# EAGLE design rj45board (EAGLE 7.2.0)
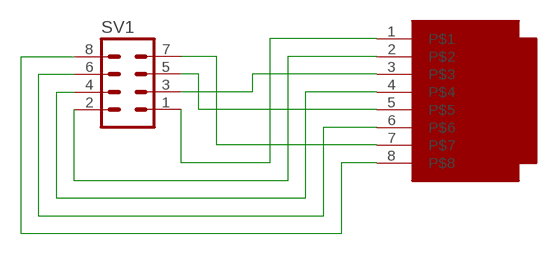
[diagram p0: schematic, sheet 1]

## Parts
SV1  MA04-2  [MA04-2]
U$1  MODULARBUCHSE  [MODULARBUCHSESMD]

## Nets
N$1: SV1.1 U$1.1
N$2: SV1.2 U$1.2
N$3: SV1.3 U$1.3
N$4: SV1.4 U$1.4
N$5: SV1.6 U$1.6
N$6: SV1.7 U$1.7
N$7: SV1.8 U$1.8
N$8: SV1.5 U$1.5

## Library data of the parts
SV1 = con-lstb:MA04-2: PIN HEADER; OC_FARNELL: unknown; OC_NEWARK: unknown
U$1 = snulllib:MODULARBUCHSE: asdf

## Board
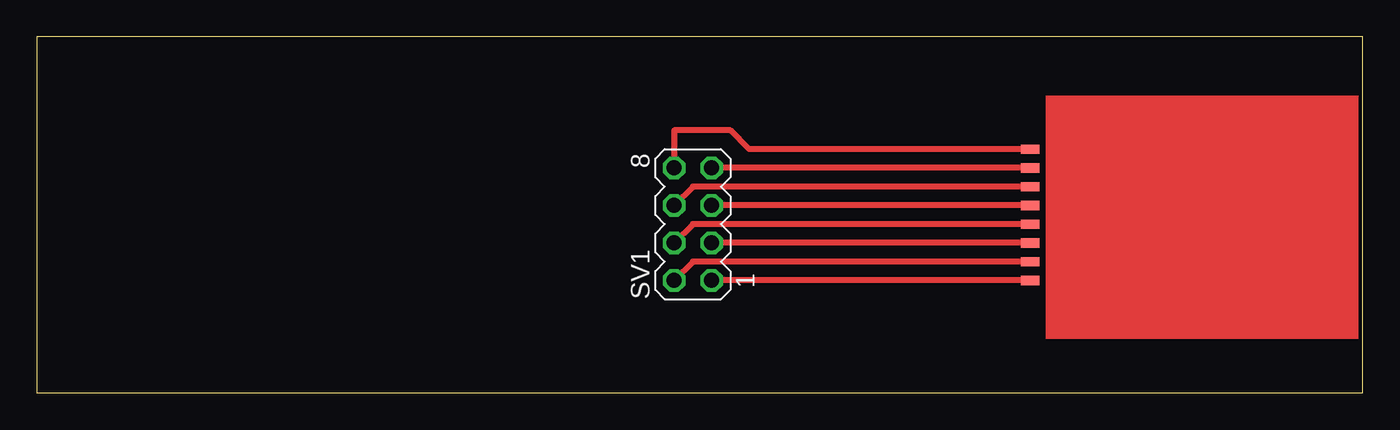
[diagram p1: board, top side]

Size 89.84 x 24.12 mm. Coordinates in mm from the lower left corner, seen from the top.
Outline: 0,0 89.84,0 89.84,24.12 0,24.12 0,0
Copper layers (1*16): Top 0.035mm / dielectric 1.5mm / Bottom 0.035mm
Design rules "default": minimum track width 10mil, minimum drill 24mil, track to track 8mil, track to pad 8mil, pad to pad 8mil, via to via 8mil, smd to smd 8mil, copper to edge 40mil, drill to drill 8mil, minimum pad ring 10mil, minimum via ring 8mil, stop-mask expansion 4mil, vias tented up to drill 0mil, thermal gap 10mil

### Footprints (pad centres in the part's own frame; a part is rotated, then mirrored left to right if it is on the bottom)
MA04-2 = drill 1.016 octagon: 1 -3.81,-1.27; 2 -3.81,1.27; 3 -1.27,-1.27; 4 -1.27,1.27; 5 1.27,-1.27; 6 1.27,1.27; 7 3.81,-1.27; 8 3.81,1.27
MODULARBUCHSESMD = smd 1.27 x 0.635: 1 0,-8.89; 2 0,-7.62; 3 0,-6.35; 4 0,-5.08; 5 0,-3.81; 6 0,-2.54; 7 0,-1.27; 8 0,0

### Placement (x,y rotation side)
SV1  44.45,11.43 90 top
U$1  67.31,16.51 0 top

### Tracks (layer width: path | path; a pad name or v marks a point on that pad's centre or on a via)
N$1
  Top 0.406: U$1.1 SV1.1
N$2
  Top 0.406: U$1.2 44.45,8.89 SV1.2
N$3
  Top 0.406: U$1.3 SV1.3
N$4
  Top 0.406: U$1.4 44.45,11.43 SV1.4
N$5
  Top 0.406: U$1.6 44.45,13.97 SV1.6
N$6
  Top 0.406: U$1.7 SV1.7
N$7
  Top 0.406: U$1.8 48.26,16.51 46.99,17.78 43.18,17.78 SV1.8
N$8
  Top 0.406: U$1.5 SV1.5